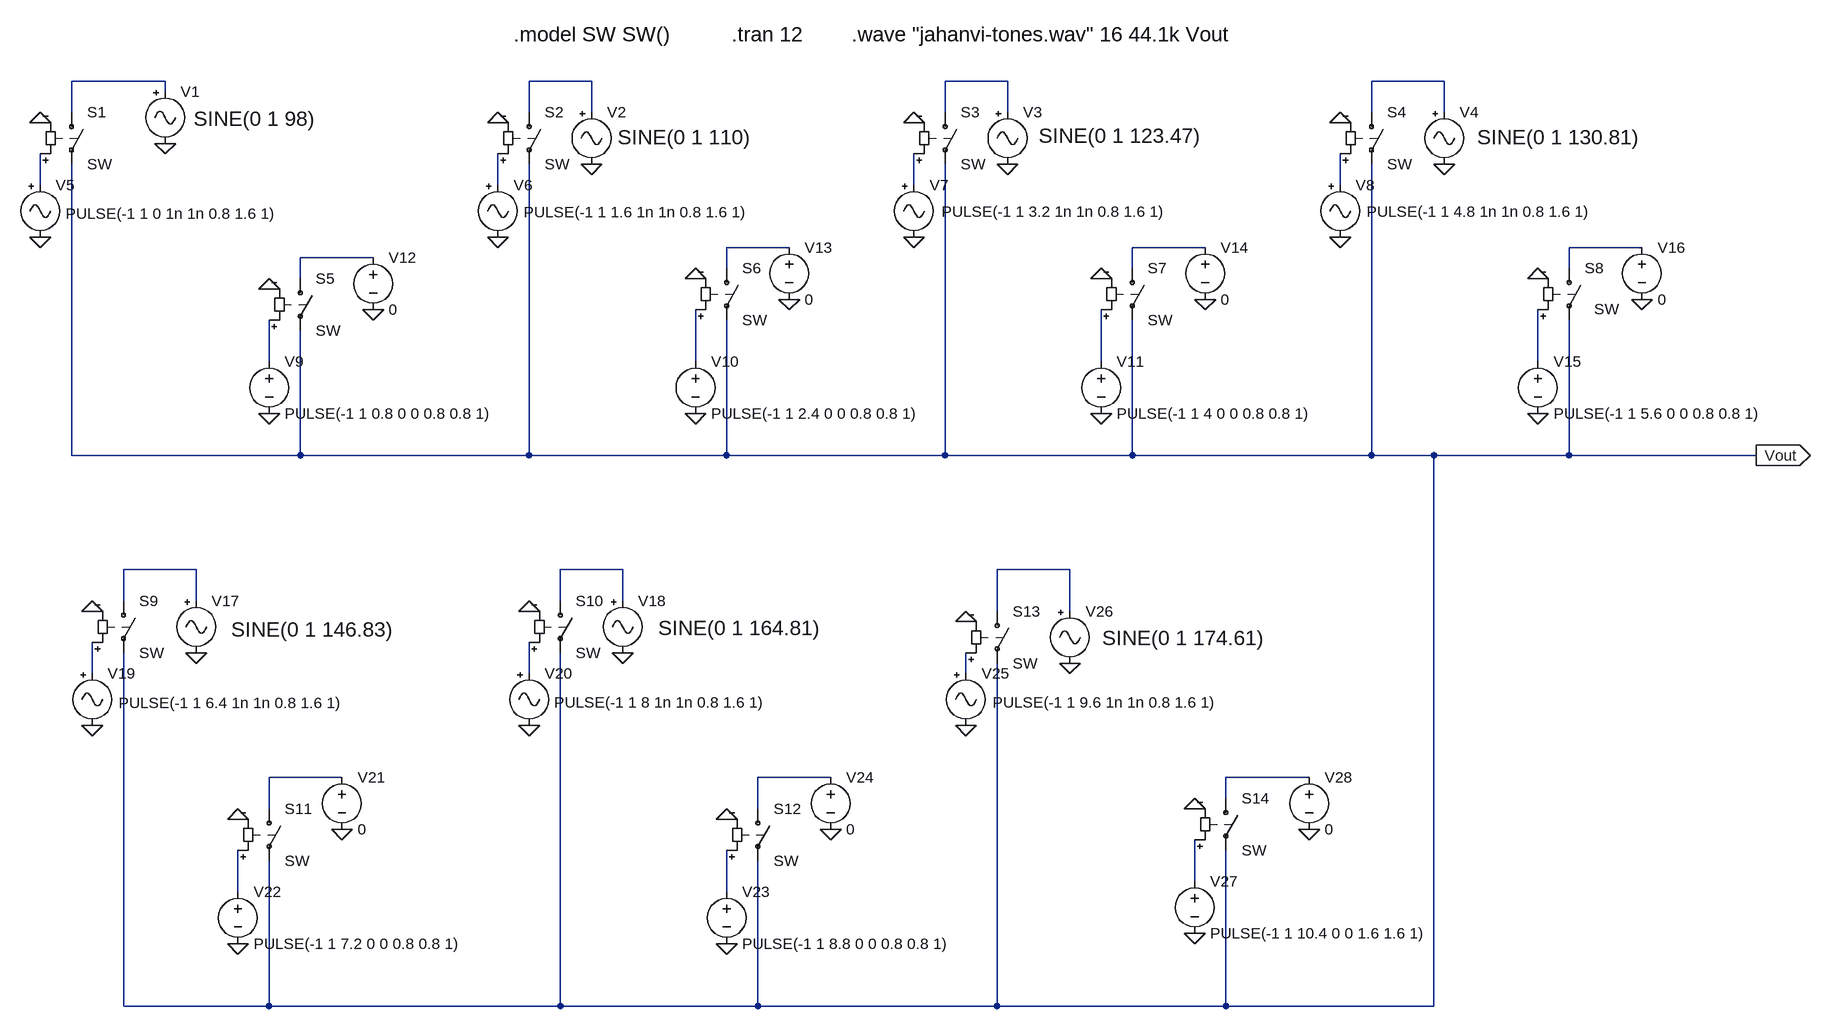
[diagram p0: schematic jahanvi-tones-circuit.asc]
jahanvi-tones-circuit.asc, the LTspice schematic file:
Version 4
SHEET 1 2432 1400
WIRE -128 -32 -272 -32
WIRE 528 -32 432 -32
WIRE 1168 -32 1072 -32
WIRE 1840 -32 1728 -32
WIRE -128 -16 -128 -32
WIRE -272 16 -272 -32
WIRE 432 16 432 -32
WIRE 528 16 528 -32
WIRE 1072 16 1072 -32
WIRE 1168 16 1168 -32
WIRE 1728 16 1728 -32
WIRE 1840 16 1840 -32
WIRE -320 128 -320 80
WIRE 384 128 384 80
WIRE 1024 128 1024 80
WIRE 1680 128 1680 80
WIRE 832 224 736 224
WIRE 1472 224 1360 224
WIRE 2144 224 2032 224
WIRE 192 240 80 240
WIRE 736 256 736 224
WIRE 1360 256 1360 224
WIRE 2032 256 2032 224
WIRE 80 272 80 240
WIRE 32 400 32 336
WIRE 688 400 688 320
WIRE 1312 400 1312 320
WIRE 1984 400 1984 320
WIRE -272 544 -272 96
WIRE 80 544 80 352
WIRE 80 544 -272 544
WIRE 432 544 432 96
WIRE 432 544 80 544
WIRE 736 544 736 336
WIRE 736 544 432 544
WIRE 1072 544 1072 96
WIRE 1072 544 736 544
WIRE 1360 544 1360 336
WIRE 1360 544 1072 544
WIRE 1728 544 1728 96
WIRE 1728 544 1360 544
WIRE 1824 544 1728 544
WIRE 2032 544 2032 336
WIRE 2032 544 1824 544
WIRE 2320 544 2032 544
WIRE -80 720 -192 720
WIRE 576 720 480 720
WIRE 1264 720 1152 720
WIRE -192 768 -192 720
WIRE -80 768 -80 720
WIRE 480 768 480 720
WIRE 576 768 576 720
WIRE 1152 784 1152 720
WIRE 1264 784 1264 720
WIRE -240 880 -240 832
WIRE 432 880 432 832
WIRE 1104 880 1104 848
WIRE 144 1040 32 1040
WIRE 896 1040 784 1040
WIRE 1632 1040 1504 1040
WIRE 1504 1072 1504 1040
WIRE 32 1088 32 1040
WIRE 784 1088 784 1040
WIRE 1456 1200 1456 1136
WIRE -16 1216 -16 1152
WIRE 736 1216 736 1152
WIRE -192 1392 -192 848
WIRE 32 1392 32 1168
WIRE 32 1392 -192 1392
WIRE 480 1392 480 848
WIRE 480 1392 32 1392
WIRE 784 1392 784 1168
WIRE 784 1392 480 1392
WIRE 1152 1392 1152 864
WIRE 1152 1392 784 1392
WIRE 1504 1392 1504 1152
WIRE 1504 1392 1152 1392
WIRE 1824 1392 1824 544
WIRE 1824 1392 1504 1392
FLAG -320 32 0
FLAG 384 32 0
FLAG 1024 32 0
FLAG 1680 32 0
FLAG -128 64 0
FLAG 528 96 0
FLAG 1168 96 0
FLAG 1840 96 0
FLAG -320 208 0
FLAG 384 208 0
FLAG 1024 208 0
FLAG 1680 208 0
FLAG 32 288 0
FLAG 1984 272 0
FLAG 32 480 0
FLAG 192 320 0
FLAG 688 480 0
FLAG 1312 480 0
FLAG 688 272 0
FLAG 1312 272 0
FLAG 832 304 0
FLAG 1472 304 0
FLAG 1984 480 0
FLAG -240 784 0
FLAG 432 784 0
FLAG -16 1104 0
FLAG 736 1104 0
FLAG -240 960 0
FLAG 432 960 0
FLAG -80 848 0
FLAG 576 848 0
FLAG -16 1296 0
FLAG 736 1296 0
FLAG 896 1120 0
FLAG 144 1120 0
FLAG 1104 960 0
FLAG 1104 800 0
FLAG 1264 864 0
FLAG 2320 544 Vout
IOPIN 2320 544 Out
FLAG 1456 1088 0
FLAG 1632 1120 0
FLAG 1456 1280 0
FLAG 2144 304 0
SYMBOL sw -272 0 R0
SYMATTR InstName S1
SYMBOL sw 432 0 R0
SYMATTR InstName S2
SYMBOL sw 1072 0 R0
SYMATTR InstName S3
SYMBOL sw 1728 0 R0
SYMATTR InstName S4
SYMBOL Misc\\signal -128 -32 R0
WINDOW 3 44 58 Left 3
WINDOW 123 0 0 Left 0
WINDOW 39 0 0 Left 0
SYMATTR Value SINE(0 1 98)
SYMATTR InstName V1
SYMBOL Misc\\signal 528 0 R0
WINDOW 3 40 54 Left 3
WINDOW 123 0 0 Left 0
WINDOW 39 0 0 Left 0
SYMATTR Value SINE(0 1 110)
SYMATTR InstName V2
SYMBOL Misc\\signal 1168 0 R0
WINDOW 3 48 52 Left 3
WINDOW 123 0 0 Left 0
WINDOW 39 0 0 Left 0
SYMATTR Value SINE(0 1 123.47)
SYMATTR InstName V3
SYMBOL Misc\\signal 1840 0 R0
WINDOW 3 51 54 Left 3
WINDOW 123 0 0 Left 0
WINDOW 39 0 0 Left 0
SYMATTR Value SINE(0 1 130.81)
SYMATTR InstName V4
SYMBOL Misc\\signal -320 112 R0
WINDOW 3 39 60 Left 2
WINDOW 123 0 0 Left 0
WINDOW 39 0 0 Left 0
SYMATTR Value PULSE(-1 1 0 1n 1n 0.8 1.6 1)
SYMATTR InstName V5
SYMBOL Misc\\signal 384 112 R0
WINDOW 3 40 58 Left 2
WINDOW 123 0 0 Left 0
WINDOW 39 0 0 Left 0
SYMATTR Value PULSE(-1 1 1.6 1n 1n 0.8 1.6 1)
SYMATTR InstName V6
SYMBOL Misc\\signal 1024 112 R0
WINDOW 3 43 57 Left 2
WINDOW 123 0 0 Left 0
WINDOW 39 0 0 Left 0
SYMATTR Value PULSE(-1 1 3.2 1n 1n 0.8 1.6 1)
SYMATTR InstName V7
SYMBOL Misc\\signal 1680 112 R0
WINDOW 3 41 57 Left 2
WINDOW 123 0 0 Left 0
WINDOW 39 0 0 Left 0
SYMATTR Value PULSE(-1 1 4.8 1n 1n 0.8 1.6 1)
SYMATTR InstName V8
SYMBOL sw 80 256 R0
SYMATTR InstName S5
SYMBOL sw 2032 240 R0
WINDOW 3 39 79 Left 2
SYMATTR InstName S8
SYMBOL voltage 32 384 R0
WINDOW 123 0 0 Left 0
WINDOW 39 0 0 Left 0
SYMATTR Value PULSE(-1 1 0.8 0 0 0.8 0.8 1)
SYMATTR InstName V9
SYMBOL sw 736 240 R0
SYMATTR InstName S6
SYMBOL sw 1360 240 R0
SYMATTR InstName S7
SYMBOL voltage 688 384 R0
WINDOW 123 0 0 Left 0
WINDOW 39 0 0 Left 0
SYMATTR Value PULSE(-1 1 2.4 0 0 0.8 0.8 1)
SYMATTR InstName V10
SYMBOL voltage 1312 384 R0
WINDOW 123 0 0 Left 0
WINDOW 39 0 0 Left 0
SYMATTR Value PULSE(-1 1 4 0 0 0.8 0.8 1)
SYMATTR InstName V11
SYMBOL voltage 832 208 R0
WINDOW 123 0 0 Left 0
WINDOW 39 0 0 Left 0
SYMATTR InstName V13
SYMATTR Value 0
SYMBOL voltage 1472 208 R0
WINDOW 123 0 0 Left 0
WINDOW 39 0 0 Left 0
SYMATTR InstName V14
SYMATTR Value 0
SYMBOL voltage 1984 384 R0
WINDOW 123 0 0 Left 0
WINDOW 39 0 0 Left 0
SYMATTR Value PULSE(-1 1 5.6 0 0 0.8 0.8 1)
SYMATTR InstName V15
SYMBOL voltage 2144 208 R0
WINDOW 123 0 0 Left 0
WINDOW 39 0 0 Left 0
SYMATTR InstName V16
SYMATTR Value 0
SYMBOL sw -192 752 R0
SYMATTR InstName S9
SYMBOL sw 480 752 R0
SYMATTR InstName S10
SYMBOL sw 32 1072 R0
SYMATTR InstName S11
SYMBOL sw 784 1072 R0
SYMATTR InstName S12
SYMBOL Misc\\signal -80 752 R0
WINDOW 3 54 60 Left 3
WINDOW 123 0 0 Left 0
WINDOW 39 0 0 Left 0
SYMATTR Value SINE(0 1 146.83)
SYMATTR InstName V17
SYMBOL Misc\\signal 576 752 R0
WINDOW 3 55 58 Left 3
WINDOW 123 0 0 Left 0
WINDOW 39 0 0 Left 0
SYMATTR Value SINE(0 1 164.81)
SYMATTR InstName V18
SYMBOL Misc\\signal -240 864 R0
WINDOW 3 41 61 Left 2
WINDOW 123 0 0 Left 0
WINDOW 39 0 0 Left 0
SYMATTR Value PULSE(-1 1 6.4 1n 1n 0.8 1.6 1)
SYMATTR InstName V19
SYMBOL Misc\\signal 432 864 R0
WINDOW 3 39 60 Left 2
WINDOW 123 0 0 Left 0
WINDOW 39 0 0 Left 0
SYMATTR Value PULSE(-1 1 8 1n 1n 0.8 1.6 1)
SYMATTR InstName V20
SYMBOL voltage 144 1024 R0
WINDOW 123 0 0 Left 0
WINDOW 39 0 0 Left 0
SYMATTR InstName V21
SYMATTR Value 0
SYMBOL voltage -16 1200 R0
WINDOW 123 0 0 Left 0
WINDOW 39 0 0 Left 0
SYMATTR Value PULSE(-1 1 7.2 0 0 0.8 0.8 1)
SYMATTR InstName V22
SYMBOL voltage 736 1200 R0
WINDOW 123 0 0 Left 0
WINDOW 39 0 0 Left 0
SYMATTR Value PULSE(-1 1 8.8 0 0 0.8 0.8 1)
SYMATTR InstName V23
SYMBOL voltage 896 1024 R0
WINDOW 123 0 0 Left 0
WINDOW 39 0 0 Left 0
SYMATTR InstName V24
SYMATTR Value 0
SYMBOL sw 1152 768 R0
SYMATTR InstName S13
SYMBOL Misc\\signal 1104 864 R0
WINDOW 3 41 60 Left 2
WINDOW 123 0 0 Left 0
WINDOW 39 0 0 Left 0
SYMATTR Value PULSE(-1 1 9.6 1n 1n 0.8 1.6 1)
SYMATTR InstName V25
SYMBOL Misc\\signal 1264 768 R0
WINDOW 3 50 57 Left 3
WINDOW 123 0 0 Left 0
WINDOW 39 0 0 Left 0
SYMATTR Value SINE(0 1 174.61)
SYMATTR InstName V26
SYMBOL sw 1504 1056 R0
SYMATTR InstName S14
SYMBOL voltage 1456 1184 R0
WINDOW 123 0 0 Left 0
WINDOW 39 0 0 Left 0
SYMATTR InstName V27
SYMATTR Value PULSE(-1 1 10.4 0 0 1.6 1.6 1)
SYMBOL voltage 1632 1024 R0
WINDOW 123 0 0 Left 0
WINDOW 39 0 0 Left 0
SYMATTR InstName V28
SYMATTR Value 0
SYMBOL voltage 192 224 R0
WINDOW 123 0 0 Left 0
WINDOW 39 0 0 Left 0
SYMATTR InstName V12
SYMATTR Value 0
TEXT 744 -104 Left 3 !.tran 12
TEXT 408 -104 Left 3 !.model SW SW()
TEXT 928 -104 Left 3 !.wave "jahanvi-tones.wav" 16 44.1k Vout

The netlist it stands for:
* jahanvi-tones-circuit.asc
S1 N001 Vout N005 0 SW
S2 N002 Vout N006 0 SW
S3 N003 Vout N007 0 SW
S4 N004 Vout N008 0 SW
V1 N001 0 SINE(0 1 98)
V2 N002 0 SINE(0 1 110)
V3 N003 0 SINE(0 1 123.47)
V4 N004 0 SINE(0 1 130.81)
V5 N005 0 PULSE(-1 1 0 1n 1n 0.8 1.6 1)
V6 N006 0 PULSE(-1 1 1.6 1n 1n 0.8 1.6 1)
V7 N007 0 PULSE(-1 1 3.2 1n 1n 0.8 1.6 1)
V8 N008 0 PULSE(-1 1 4.8 1n 1n 0.8 1.6 1)
S5 N012 Vout N013 0 SW
S8 N011 Vout N016 0 SW
V9 N013 0 PULSE(-1 1 0.8 0 0 0.8 0.8 1)
S6 N009 Vout N014 0 SW
S7 N010 Vout N015 0 SW
V10 N014 0 PULSE(-1 1 2.4 0 0 0.8 0.8 1)
V11 N015 0 PULSE(-1 1 4 0 0 0.8 0.8 1)
V13 N009 0 0
V14 N010 0 0
V15 N016 0 PULSE(-1 1 5.6 0 0 0.8 0.8 1)
V16 N011 0 0
S9 N017 Vout N020 0 SW
S10 N018 Vout N021 0 SW
S11 N023 Vout N027 0 SW
S12 N024 Vout N028 0 SW
V17 N017 0 SINE(0 1 146.83)
V18 N018 0 SINE(0 1 164.81)
V19 N020 0 PULSE(-1 1 6.4 1n 1n 0.8 1.6 1)
V20 N021 0 PULSE(-1 1 8 1n 1n 0.8 1.6 1)
V21 N023 0 0
V22 N027 0 PULSE(-1 1 7.2 0 0 0.8 0.8 1)
V23 N028 0 PULSE(-1 1 8.8 0 0 0.8 0.8 1)
V24 N024 0 0
S13 N019 Vout N022 0 SW
V25 N022 0 PULSE(-1 1 9.6 1n 1n 0.8 1.6 1)
V26 N019 0 SINE(0 1 174.61)
S14 N025 Vout N026 0 SW
V27 N026 0 PULSE(-1 1 10.4 0 0 1.6 1.6 1)
V28 N025 0 0
V12 N012 0 0
.tran 12
.model SW SW()
.wave "jahanvi-tones.wav" 16 44.1k Vout
.backanno
.end